# EAGLE design protoslice (EAGLE 8.2.2)
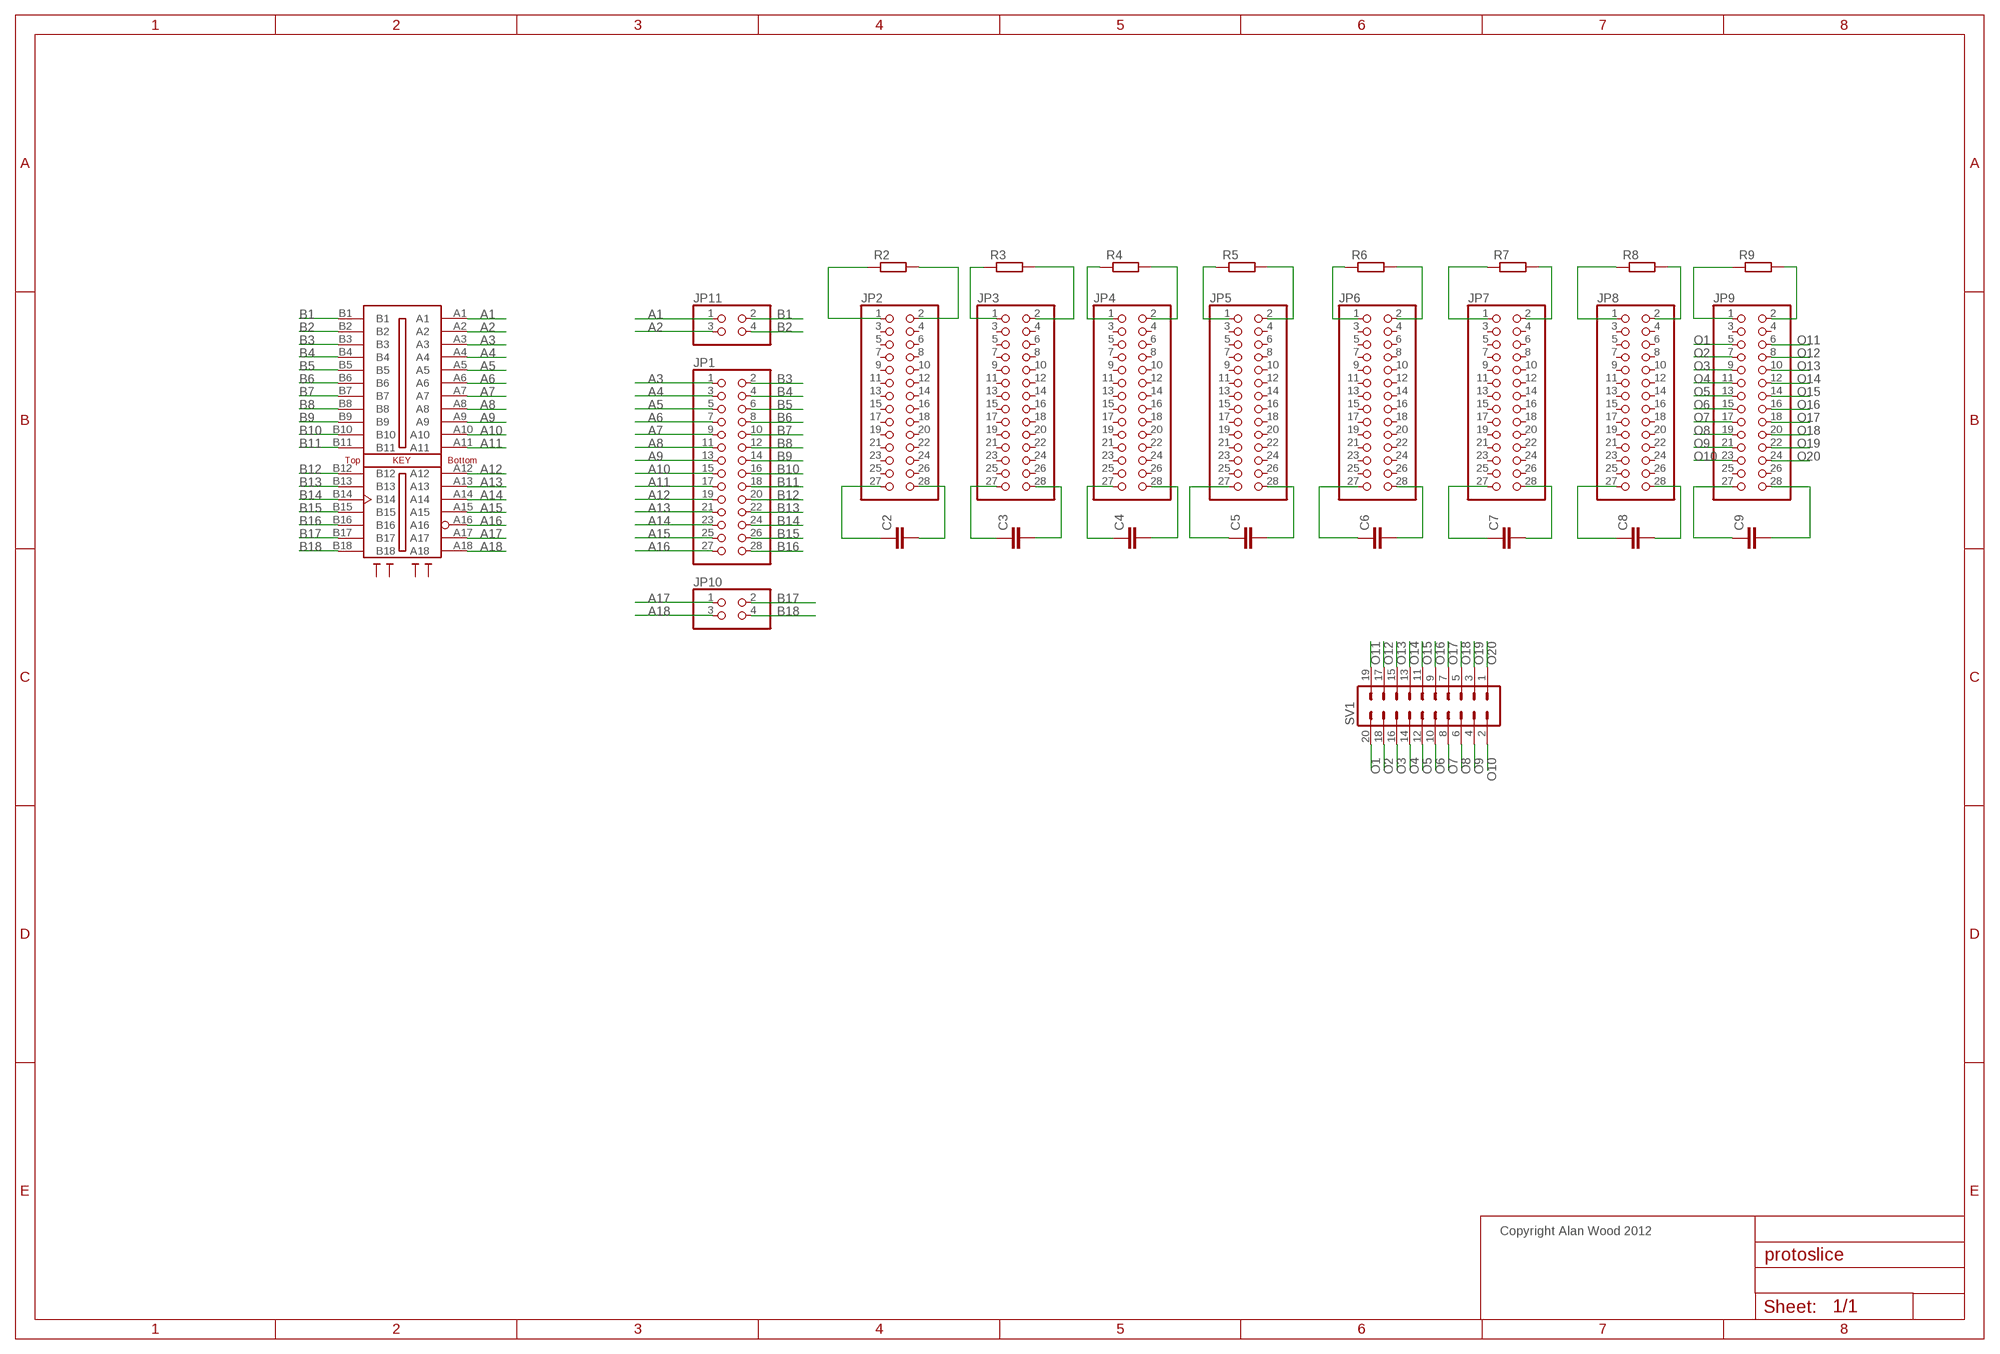
[diagram p0: schematic, sheet 1]

## Parts
C2  C-EUC0805  [C0805]
C3  C-EUC0805  [C0805]
C4  C-EUC0805  [C0805]
C5  C-EUC0805  [C0805]
C6  C-EUC0805  [C0805]
C7  C-EUC0805  [C0805]
C8  C-EUC0805  [C0805]
C9  C-EUC0805  [C0805]
JP1  PINHD-2X14  [2X14]
JP2  PINHD-2X14  [2X14]
JP3  PINHD-2X14  [2X14]
JP4  PINHD-2X14  [2X14]
JP5  PINHD-2X14  [2X14]
JP6  PINHD-2X14  [2X14]
JP7  PINHD-2X14  [2X14]
JP8  PINHD-2X14  [2X14]
JP9  PINHD-2X14  [2X14]
JP10  PINHD-2X2  [2X02]
JP11  PINHD-2X2  [2X02]
R2  R-EU_R0805  [R0805]
R3  R-EU_R0805  [R0805]
R4  R-EU_R0805  [R0805]
R5  R-EU_R0805  [R0805]
R6  R-EU_R0805  [R0805]
R7  R-EU_R0805  [R0805]
R8  R-EU_R0805  [R0805]
R9  R-EU_R0805  [R0805]
SV1  MA10-2W  [MA10-2W]
U$1  XSLICE  [XSLICE]

## Nets
A1: JP11.1 U$1.A1
A2: JP11.3 U$1.A2
A3: JP1.1 U$1.A3
A4: JP1.3 U$1.A4
A5: JP1.5 U$1.A5
A6: JP1.7 U$1.A6
A7: JP1.9 U$1.A7
A8: JP1.11 U$1.A8
A9: JP1.13 U$1.A9
A10: JP1.15 U$1.A10
A11: JP1.17 U$1.A11
A12: JP1.19 U$1.A12
A13: JP1.21 U$1.A13
A14: JP1.23 U$1.A14
A15: JP1.25 U$1.A15
A16: JP1.27 U$1.A16
A17: JP10.1 U$1.A17
A18: JP10.3 U$1.A18
B1: JP11.2 U$1.B1
B2: JP11.4 U$1.B2
B3: JP1.2 U$1.B3
B4: JP1.4 U$1.B4
B5: JP1.6 U$1.B5
B6: JP1.8 U$1.B6
B7: JP1.10 U$1.B7
B8: JP1.12 U$1.B8
B9: JP1.14 U$1.B9
B10: JP1.16 U$1.B10
B11: JP1.18 U$1.B11
B12: JP1.20 U$1.B12
B13: JP1.22 U$1.B13
B14: JP1.24 U$1.B14
B15: JP1.26 U$1.B15
B16: JP1.28 U$1.B16
B17: JP10.2 U$1.B17
B18: JP10.4 U$1.B18
N$1: JP2.1 R2.1
N$2: JP2.2 R2.2
N$3: C2.1 JP2.27
N$4: C2.2 JP2.28
N$5: JP3.1 R3.1
N$6: JP3.2 R3.2
N$7: JP4.1 R4.1
N$8: JP4.2 R4.2
N$9: JP5.1 R5.1
N$10: JP5.2 R5.2
N$11: JP6.1 R6.1
N$12: JP6.2 R6.2
N$13: JP7.1 R7.1
N$14: JP7.2 R7.2
N$15: C7.1 JP7.27
N$16: C7.2 JP7.28
N$17: C6.2 JP6.28
N$18: C6.1 JP6.27
N$19: C5.2 JP5.28
N$20: C5.1 JP5.27
N$21: C4.2 JP4.28
N$22: C4.1 JP4.27
N$23: C3.2 JP3.28
N$24: C3.1 JP3.27
N$25: JP8.1 R8.1
N$26: JP8.2 R8.2
N$27: C8.1 JP8.27
N$28: C8.2 JP8.28
N$29: C9.1 JP9.27
N$30: C9.2 JP9.28
N$31: JP9.1 R9.1
N$32: JP9.2 R9.2
O1: JP9.5 SV1.20
O2: JP9.7 SV1.18
O3: JP9.9 SV1.16
O4: JP9.11 SV1.14
O5: JP9.13 SV1.12
O6: JP9.15 SV1.10
O7: JP9.17 SV1.8
O8: JP9.19 SV1.6
O9: JP9.21 SV1.4
O10: JP9.23 SV1.2
O11: JP9.6 SV1.19
O12: JP9.8 SV1.17
O13: JP9.10 SV1.15
O14: JP9.12 SV1.13
O15: JP9.14 SV1.11
O16: JP9.16 SV1.9
O17: JP9.18 SV1.7
O18: JP9.20 SV1.5
O19: JP9.22 SV1.3
O20: JP9.24 SV1.1
Unconnected: JP2.3 JP2.4 JP2.5 JP2.6 JP2.7 JP2.8 JP2.9 JP2.10 JP2.11 JP2.12 JP2.13 JP2.14 JP2.15 JP2.16 JP2.17 JP2.18 JP2.19 JP2.20 JP2.21 JP2.22 JP2.23 JP2.24 JP2.25 JP2.26 JP3.3 JP3.4 JP3.5 JP3.6 JP3.7 JP3.8 JP3.9 JP3.10 JP3.11 JP3.12 JP3.13 JP3.14 JP3.15 JP3.16 JP3.17 JP3.18 JP3.19 JP3.20 JP3.21 JP3.22 JP3.23 JP3.24 JP3.25 JP3.26 JP4.3 JP4.4 JP4.5 JP4.6 JP4.7 JP4.8 JP4.9 JP4.10 JP4.11 JP4.12 JP4.13 JP4.14 JP4.15 JP4.16 JP4.17 JP4.18 JP4.19 JP4.20 JP4.21 JP4.22 JP4.23 JP4.24 JP4.25 JP4.26 JP5.3 JP5.4 JP5.5 JP5.6 JP5.7 JP5.8 JP5.9 JP5.10 JP5.11 JP5.12 JP5.13 JP5.14 JP5.15 JP5.16 JP5.17 JP5.18 JP5.19 JP5.20 JP5.21 JP5.22 JP5.23 JP5.24 JP5.25 JP5.26 JP6.3 JP6.4 JP6.5 JP6.6 JP6.7 JP6.8 JP6.9 JP6.10 JP6.11 JP6.12 JP6.13 JP6.14 JP6.15 JP6.16 JP6.17 JP6.18 JP6.19 JP6.20 JP6.21 JP6.22 JP6.23 JP6.24 JP6.25 JP6.26 JP7.3 JP7.4 JP7.5 JP7.6 JP7.7 JP7.8 JP7.9 JP7.10 JP7.11 JP7.12 JP7.13 JP7.14 JP7.15 JP7.16 JP7.17 JP7.18 JP7.19 JP7.20 JP7.21 JP7.22 JP7.23 JP7.24 JP7.25 JP7.26 JP8.3 JP8.4 JP8.5 JP8.6 JP8.7 JP8.8 JP8.9 JP8.10 JP8.11 JP8.12 JP8.13 JP8.14 JP8.15 JP8.16 JP8.17 JP8.18 JP8.19 JP8.20 JP8.21 JP8.22 JP8.23 JP8.24 JP8.25 JP8.26 JP9.3 JP9.4 JP9.25 JP9.26 U$1.H0 U$1.H1 U$1.H2 U$1.H3

## Notes on the sheet
- Copyright Alan Wood 2012

## Library data of the parts
C2-C9 = rcl:C-EU: CAPACITOR, European symbol
JP1-JP9 = pinhead:PINHD-2X14: PIN HEADER
JP10 JP11 = pinhead:PINHD-2X2: PIN HEADER
R2-R9 = rcl:R-EU_: RESISTOR, European symbol
SV1 = con-lstb:MA10-2W: PIN HEADER; OC_FARNELL: unknown; OC_NEWARK: unknown
U$1 = amino:XSLICE

## Net classes
0 default: width 0.254 mm

## Board
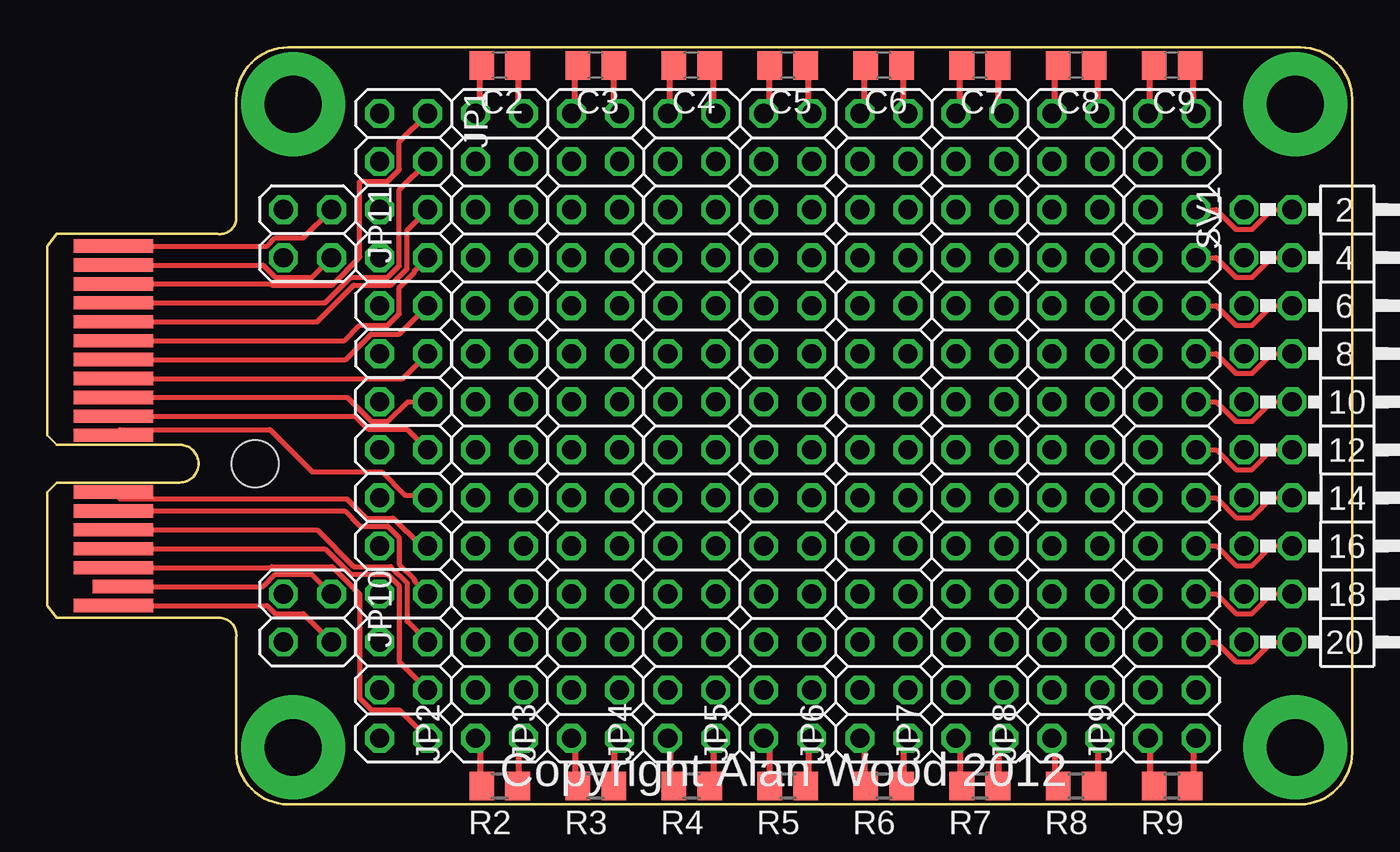
[diagram p1: board, top side]
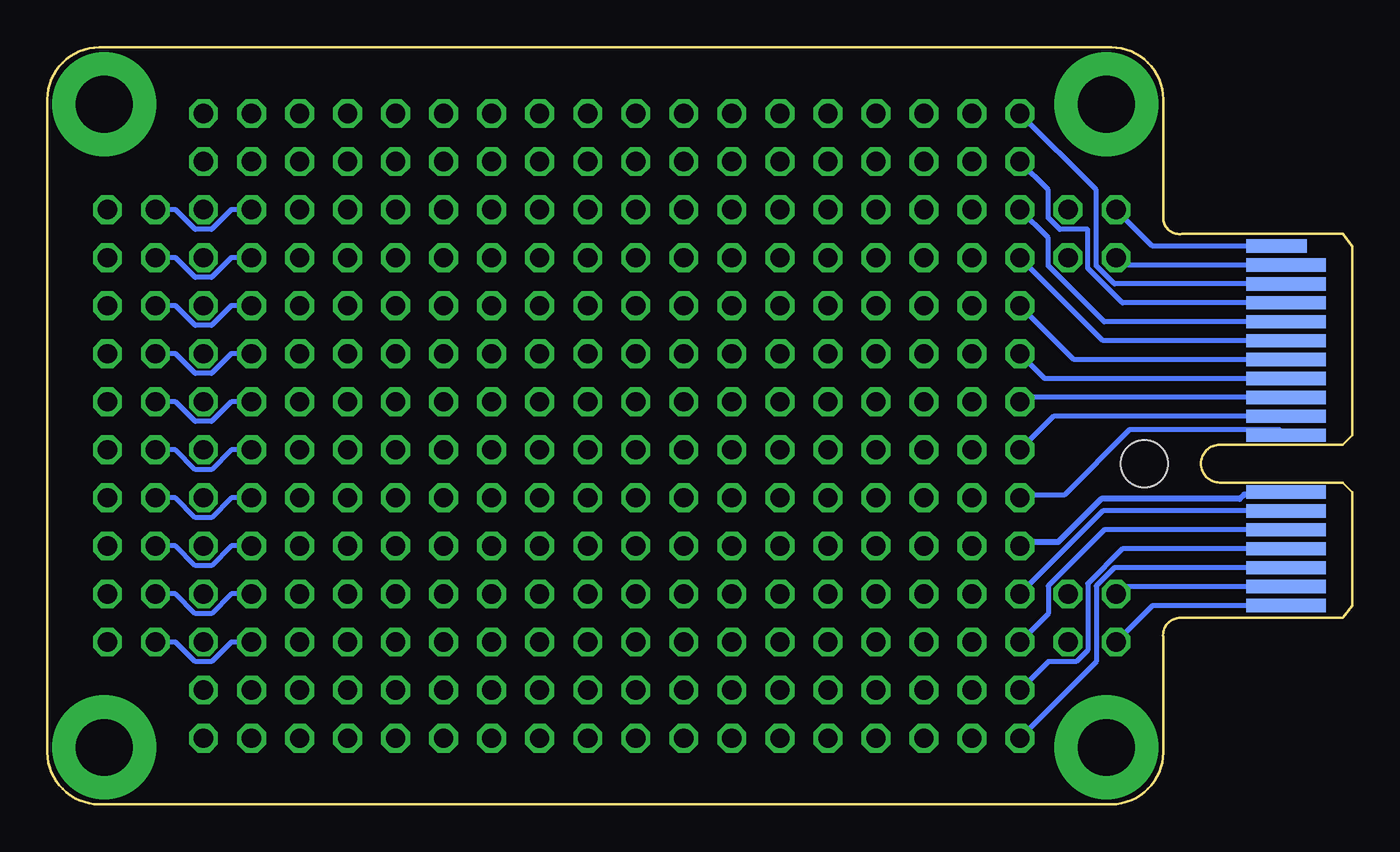
[diagram p2: board, bottom side, seen from below]

Size 69.01 x 40.02 mm. Coordinates in mm from the lower left corner, seen from the top.
Copper layers (1*16): Top 0.0356mm / dielectric 1.5011mm / Bottom 0.0356mm
Design rules "LaenPCBOrder": minimum track width 6mil, minimum drill 13mil, track to track 6mil, track to pad 6mil, pad to pad 6mil, via to via 6mil, smd to smd 6mil, copper to edge 15mil, drill to drill 6mil, minimum pad ring 7mil, minimum via ring 7mil, stop-mask expansion 3mil, vias tented up to drill 0mil, thermal gap 10mil

### Footprints (pad centres in the part's own frame; a part is rotated, then mirrored left to right if it is on the bottom)
C0805 = smd 1.3 x 1.5: 1 -0.95,0; 2 0.95,0
2X14 = drill 1.016 octagon: 1 -16.51,-1.27; 2 -16.51,1.27; 3 -13.97,-1.27; 4 -13.97,1.27; 5 -11.43,-1.27; 6 -11.43,1.27; 7 -8.89,-1.27; 8 -8.89,1.27; 9 -6.35,-1.27; 10 -6.35,1.27; 11 -3.81,-1.27; 12 -3.81,1.27; 13 -1.27,-1.27; 14 -1.27,1.27; 15 1.27,-1.27; 16 1.27,1.27; 17 3.81,-1.27; 18 3.81,1.27; 19 6.35,-1.27; 20 6.35,1.27; 21 8.89,-1.27; 22 8.89,1.27; 23 11.43,-1.27; 24 11.43,1.27; 25 13.97,-1.27; 26 13.97,1.27; 27 16.51,-1.27; 28 16.51,1.27
2X02 = drill 1.016 octagon: 1 -1.27,-1.27; 2 -1.27,1.27; 3 1.27,-1.27; 4 1.27,1.27
R0805 = smd 1.3 x 1.5: 1 -0.95,0; 2 0.95,0
MA10-2W = drill 1.016 octagon: 1 -11.43,-1.27; 2 -11.43,1.27; 3 -8.89,-1.27; 4 -8.89,1.27; 5 -6.35,-1.27; 6 -6.35,1.27; 7 -3.81,-1.27; 8 -3.81,1.27; 9 -1.27,-1.27; 10 -1.27,1.27; 11 1.27,-1.27; 12 1.27,1.27; 13 3.81,-1.27; 14 3.81,1.27; 15 6.35,-1.27; 16 6.35,1.27; 17 8.89,-1.27; 18 8.89,1.27; 19 11.43,-1.27; 20 11.43,1.27
XSLICE = smd 3.2 x 0.7 bottom: A1 -36.43,9.5 | smd 4.2 x 0.7 bottom: A2 -36.93,8.5; A3 -36.93,7.5; A4 -36.93,6.5; A5 -36.93,5.5; A6 -36.93,4.5; A7 -36.93,3.5; A8 -36.93,2.5; A9 -36.93,1.5; A10 -36.93,0.5; A11 -36.93,-0.5; A12 -36.93,-3.5; A13 -36.93,-4.5; A14 -36.93,-5.5; A15 -36.93,-6.5; A16 -36.93,-7.5; A17 -36.93,-8.5; A18 -36.93,-9.5 | smd 4.2 x 0.7: B1 -36.93,9.5; B2 -36.93,8.5; B3 -36.93,7.5; B4 -36.93,6.5; B5 -36.93,5.5; B6 -36.93,4.5; B7 -36.93,3.5; B8 -36.93,2.5; B9 -36.93,1.5; B10 -36.93,0.5; B11 -36.93,-0.5; B12 -36.93,-3.5; B13 -36.93,-4.5; B14 -36.93,-5.5; B15 -36.93,-6.5; B16 -36.93,-7.5; B18 -36.93,-9.5 | smd 3.2 x 0.7: B17 -36.43,-8.5 | drill 3 pad 5.5: H0 -27.43,-17; H1 25.57,-17; H2 -27.43,17; H3 25.57,17 | hole 2.5: -29.43,-2

### Placement (x,y rotation side)
C2  23.92,39.06 180 top
C3  29,39.06 180 top
C4  34.08,39.06 180 top
C5  39.16,39.06 180 top
C6  44.24,39.06 180 top
C7  49.32,39.06 180 top
C8  54.4,39.06 180 top
C9  59.48,39.06 180 top
JP1  18.84,20.01 270 top
JP2  23.92,20.01 90 top
JP3  29,20.01 90 top
JP4  34.08,20.01 90 top
JP5  39.16,20.01 90 top
JP6  44.24,20.01 90 top
JP7  49.32,20.01 90 top
JP8  54.4,20.01 90 top
JP9  59.48,20.01 90 top
JP10  13.76,9.85 270 top
JP11  13.76,30.17 270 top
R2  23.92,0.96 180 top
R3  29,0.96 180 top
R4  34.08,0.96 180 top
R5  39.16,0.96 180 top
R6  44.24,0.96 180 top
R7  49.32,0.96 180 top
R8  54.4,0.96 180 top
R9  59.48,0.96 180 top
SV1  64.56,20.01 270 top
U$1  40.43,20.01 0 top

### Tracks (layer width: path | path; a pad name or v marks a point on that pad's centre or on a via)
A1
  Bottom 0.254: U$1.A1 10.56,29.51 JP11.1
A2
  Bottom 0.254: U$1.A2 12.1,28.51 JP11.3
A3
  Bottom 0.254: JP1.1 13.53,32.48 13.53,28.47 12.57,27.51 U$1.A3
A4
  Bottom 0.254: JP1.3 16.07,32.48 16.07,31.01 15.46,30.4 13.99,30.4 13.99,28.35 12.15,26.51 U$1.A4
A5
  Bottom 0.254: JP1.5 16.07,29.94 16.07,28.47 13.11,25.51 U$1.A5
A6
  Bottom 0.254: U$1.A6 13.18,24.51 JP1.7
A7
  Bottom 0.254: U$1.A7 14.72,23.51 JP1.9
A8
  Bottom 0.254: U$1.A8 16.26,22.51 JP1.11
A9
  Bottom 0.254: U$1.A9 17.34,21.51 JP1.13
A10
  Bottom 0.254: U$1.A10 15.8,20.51 JP1.15
A11
  Bottom 0.254: JP1.17 17.47,16.35 15.23,16.35 11.78,19.81 3.85,19.81 3.65,19.6 U$1.A11
A12
  Bottom 0.305: JP1.19 17.39,13.86 15.56,13.86 13.28,16.15 5.96,16.15 5.73,16.38 3.68,16.38 U$1.A12
A13
  Bottom 0.254: U$1.A13 13.18,15.51 JP1.21
A14
  Bottom 0.254: JP1.23 16.07,10.08 16.07,11.55 13.11,14.51 U$1.A14
A15
  Bottom 0.254: JP1.25 16.07,7.54 14.6,7.54 13.99,8.15 13.99,11.67 12.15,13.51 U$1.A15
A16
  Bottom 0.254: JP1.27 13.53,7.54 13.53,11.55 12.57,12.51 U$1.A16
A17
  Bottom 0.254: U$1.A17 12.1,11.51 JP10.1
A18
  Bottom 0.254: U$1.A18 10.56,10.51 JP10.3
B1
  Top 0.254: U$1.B1 11.63,29.51 12.06,29.94 13.53,29.94 JP11.2
B2
  Top 0.254: U$1.B2 11.41,28.51 12.06,27.86 13.99,27.86 JP11.4
B3
  Top 0.254: JP1.2 18.61,35.02 18.61,33.55 18,32.94 16.53,32.94 16.53,28.93 15.05,27.45 11.89,27.45 11.83,27.51 U$1.B3
B4
  Top 0.254: U$1.B4 14.69,26.51 16.04,27.86 18,27.86 18.61,28.47 18.61,32.48 JP1.4
B5
  Top 0.254: JP1.6 19.02,30.35 19.02,28.3 18.17,27.45 16.2,27.45 14.26,25.51 U$1.B5
B6
  Top 0.254: U$1.B6 15.72,24.51 16.53,25.32 18,25.32 18.61,25.93 18.61,27.32 19.42,28.13 19.42,28.21 JP1.8
B7
  Top 0.254: U$1.B7 15.79,23.51 17.14,24.86 18.61,24.86 JP1.10
B8
  Top 0.254: U$1.B8 18.8,22.51 JP1.12
B9
  Top 0.254: U$1.B9 15.87,21.51 17.14,20.24 18,20.24 19.04,21.28 JP1.14
B10
  Top 0.254: U$1.B10 16.29,20.51 16.97,19.83 19.02,19.83 JP1.16
B11
  Top 0.254: JP1.18 20.11,16.35 18.89,16.35 17.67,17.57 14.01,17.57 11.78,19.81 3.85,19.81 3.65,19.6 U$1.B11
B12
  Top 0.254: JP1.20 20.11,13.71 19.7,13.71 18.28,15.13 16.86,15.13 15.84,16.15 3.85,16.15 3.65,16.35 U$1.B12
B13
  Top 0.254: U$1.B13 15.72,15.51 16.53,14.7 18,14.7 18.61,14.09 18.61,12.7 19.42,11.89 19.42,11.81 JP1.22
B14
  Top 0.254: JP1.24 19.02,9.67 19.02,11.72 18.17,12.57 16.2,12.57 14.26,14.51 U$1.B14
B15
  Top 0.254: U$1.B15 14.69,13.51 16.04,12.16 18,12.16 18.61,11.55 18.61,7.54 JP1.26
B16
  Top 0.254: JP1.28 18.61,5 17.14,5 16.53,5.61 16.53,11.09 15.05,12.57 11.89,12.57 11.83,12.51 U$1.B16
B17
  Top 0.254: U$1.B17 11.41,11.51 12.06,12.16 13.99,12.16 JP10.2
B18
  Top 0.254: U$1.B18 11.63,10.51 12.06,10.08 13.53,10.08 JP10.4
N$1
  Top 0.305: R2.1 24.94,1.06 24.94,3.12 25.16,3.35 JP2.1
N$2
  Top 0.305: R2.2 22.88,1.06 22.88,3.12 22.65,3.35 JP2.2
N$3
  Top 0.305: C2.1 24.94,39.01 24.94,36.95 25.16,36.72 JP2.27
N$4
  Top 0.305: C2.2 22.88,39.01 22.88,36.95 22.65,36.72 JP2.28
N$5
  Top 0.305: R3.1 29.96,1.06 29.96,3.12 30.19,3.35 JP3.1
N$6
  Top 0.305: R3.2 27.91,1.06 27.91,3.35 JP3.2
N$7
  Top 0.305: R4.1 35.22,1.06 35.22,3.35 JP4.1
N$8
  Top 0.305: R4.2 32.94,1.06 32.94,3.35 JP4.2
N$9
  Top 0.305: R5.1 40.25,1.06 40.25,3.35 JP5.1
N$10
  Top 0.305: R5.2 38.2,1.06 38.2,3.12 37.97,3.35 JP5.2
N$11
  Top 0.305: R6.1 45.28,1.06 45.28,3.12 45.51,3.35 JP6.1
N$12
  Top 0.305: R6.2 43.22,1.06 43.22,3.12 42.99,3.35 JP6.2
N$13
  Top 0.305: R7.1 50.31,1.06 50.31,3.12 50.54,3.35 JP7.1
N$14
  Top 0.305: R7.2 48.25,1.06 48.25,3.35 JP7.2
N$15
  Top 0.305: C7.1 50.31,39.01 50.31,36.95 50.54,36.72 JP7.27
N$16
  Top 0.305: C7.2 48.25,39.01 48.25,36.72 JP7.28
N$17
  Top 0.305: C6.2 43.22,39.01 43.22,36.95 42.99,36.72 JP6.28
N$18
  Top 0.305: C6.1 45.28,39.01 45.28,36.95 45.51,36.72 JP6.27
N$19
  Top 0.305: C5.2 38.2,39.01 38.2,36.95 37.97,36.72 JP5.28
N$20
  Top 0.305: C5.1 40.25,39.01 40.25,36.72 JP5.27
N$21
  Top 0.305: C4.2 32.94,39.01 32.94,36.72 JP4.28
N$22
  Top 0.305: C4.1 35.22,39.01 35.22,36.72 JP4.27
N$23
  Top 0.305: C3.2 27.91,39.01 27.91,36.72 JP3.28
N$24
  Top 0.305: C3.1 29.96,39.01 29.96,36.95 30.19,36.72 JP3.27
N$25
  Top 0.305: R8.1 55.57,1.06 55.57,3.35 JP8.1
N$26
  Top 0.305: R8.2 53.28,1.06 53.28,3.35 JP8.2
N$27
  Top 0.305: C8.1 55.57,39.01 55.57,36.72 JP8.27
N$28
  Top 0.305: C8.2 53.28,39.01 53.28,36.72 JP8.28
N$29
  Top 0.305: C9.1 60.6,39.01 60.6,36.72 JP9.27
N$30
  Top 0.305: C9.2 58.31,39.01 58.31,36.72 JP9.28
N$31
  Top 0.305: R9.1 60.6,1.06 60.6,3.35 JP9.1
N$32
  Top 0.305: R9.2 58.31,1.06 58.31,3.35 JP9.2
O1
  Top 0.254: JP9.5 61.82,8.58 62.86,7.54 63.72,7.54 64.76,8.58 SV1.20
O2
  Top 0.254: JP9.7 61.82,11.12 62.86,10.08 63.72,10.08 64.76,11.12 SV1.18
O3
  Top 0.254: JP9.9 61.82,13.66 62.86,12.62 63.72,12.62 64.76,13.66 SV1.16
O4
  Top 0.254: JP9.11 61.82,16.2 62.86,15.16 63.72,15.16 64.76,16.2 SV1.14
O5
  Top 0.254: JP9.13 61.82,18.74 62.86,17.7 63.72,17.7 64.76,18.74 SV1.12
O6
  Top 0.254: JP9.15 61.82,21.28 62.86,20.24 63.72,20.24 64.76,21.28 SV1.10
O7
  Top 0.254: JP9.17 61.82,23.82 62.86,22.78 63.72,22.78 64.76,23.82 SV1.8
O8
  Top 0.254: JP9.19 61.82,26.36 62.86,25.32 63.72,25.32 64.76,26.36 SV1.6
O9
  Top 0.254: JP9.21 61.82,28.9 62.86,27.86 63.72,27.86 64.76,28.9 SV1.4
O10
  Top 0.254: JP9.23 61.82,31.44 62.86,30.4 63.72,30.4 64.76,31.44 SV1.2
O11
  Bottom 0.254: JP9.6 59.28,8.58 60.32,7.54 61.18,7.54 62.22,8.58 SV1.19
O12
  Bottom 0.254: JP9.8 59.28,11.12 60.32,10.08 61.18,10.08 62.22,11.12 SV1.17
O13
  Bottom 0.254: JP9.10 59.28,13.66 60.32,12.62 61.18,12.62 62.22,13.66 SV1.15
O14
  Bottom 0.254: JP9.12 59.28,16.2 60.32,15.16 61.18,15.16 62.22,16.2 SV1.13
O15
  Bottom 0.254: JP9.14 59.28,18.74 60.32,17.7 61.18,17.7 62.22,18.74 SV1.11
O16
  Bottom 0.254: JP9.16 59.28,21.28 60.32,20.24 61.18,20.24 62.22,21.28 SV1.9
O17
  Bottom 0.254: JP9.18 59.28,23.82 60.32,22.78 61.18,22.78 62.22,23.82 SV1.7
O18
  Bottom 0.254: JP9.20 59.28,26.36 60.32,25.32 61.18,25.32 62.22,26.36 SV1.5
O19
  Bottom 0.254: JP9.22 59.28,28.9 60.32,27.86 61.18,27.86 62.22,28.9 SV1.3
O20
  Bottom 0.254: JP9.24 59.28,31.44 60.32,30.4 61.18,30.4 62.22,31.44 SV1.1

### Text on the board
tNames: Copyright Alan Wood 2012